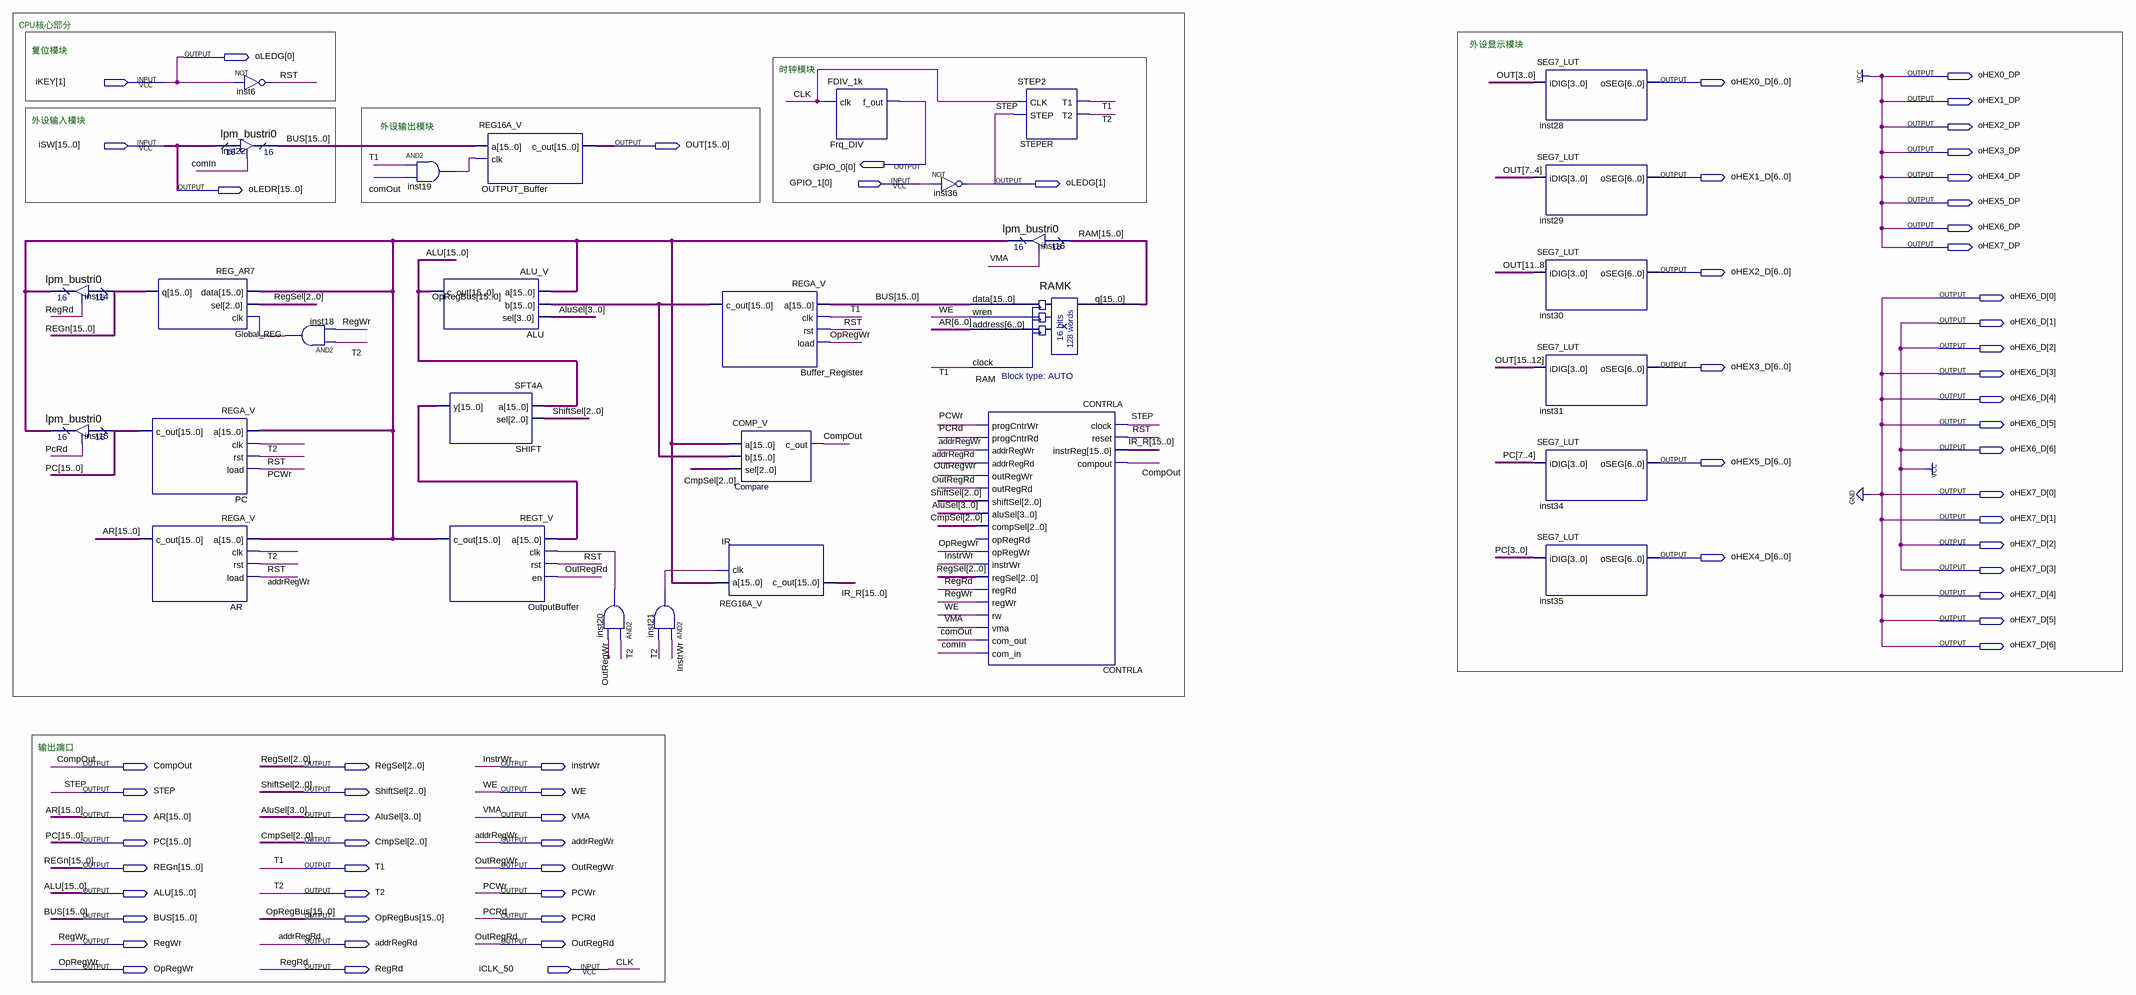
[diagram p0: schematic sheet]
// Quartus schematic kx9016.bdf as structural Verilog: 30 symbols, 63 pins
module kx9016 (
  input  [1:1] iKEY,
  input  [15:0] iSW,
  input  [0:0] GPIO_1,
  input  iCLK_50,
  output [1:0] oLEDG,
  output oHEX0_DP,
  output [6:0] oHEX0_D,
  output oHEX1_DP,
  output oHEX2_DP,
  output [15:0] OUT,
  output oHEX3_DP,
  output [0:0] GPIO_0,
  output [6:0] oHEX1_D,
  output oHEX4_DP,
  output [15:0] oLEDR,
  output oHEX5_DP,
  output oHEX6_DP,
  output oHEX7_DP,
  output [6:0] oHEX2_D,
  output [6:0] oHEX6_D,
  output [6:0] oHEX3_D,
  output [6:0] oHEX5_D,
  output [6:0] oHEX7_D,
  output [6:0] oHEX4_D,
  output CompOut,
  output [2:0] RegSel,
  output instrWr,
  output STEP,
  output [2:0] ShiftSel,
  output WE,
  output [15:0] AR,
  output [3:0] AluSel,
  output VMA,
  output [15:0] PC,
  output [2:0] CmpSel,
  output addrRegWr,
  output [15:0] REGn,
  output T1,
  output OutRegWr,
  output [15:0] ALU,
  output T2,
  output PCWr,
  output [15:0] BUS,
  output [15:0] OpRegBus,
  output PCRd,
  output RegWr,
  output addrRegRd,
  output OutRegRd,
  output OpRegWr,
  output RegRd
);

  wire comIn, comOut, inst18_out, inst19_out, inst20_out, inst21_out, RST;
  wire [15:0] inst14_tridata, IR_R, RAM, SHIFT_y;

  lpm_bustri0 inst14 (.enabledt(RegRd), .data(REGn), .tridata(inst14_tridata));
  lpm_bustri0 inst15 (.enabledt(PCRd), .data(PC), .tridata(inst14_tridata));
  REG_AR7 Global_REG (.data(inst14_tridata), .sel(RegSel), .clk(inst18_out), .q(REGn));
  REGA_V u_PC (.a(inst14_tridata), .clk(T2), .rst(RST), .load(PCWr), .c_out(PC));
  REGA_V u_AR (.a(inst14_tridata), .clk(T2), .rst(RST), .load(addrRegWr), .c_out(AR));
  lpm_bustri0 inst22 (.enabledt(comIn), .data(iSW), .tridata(BUS));
  not inst6 (RST, iKEY[1]);
  and inst18 (inst18_out, T2, RegWr);
  and inst19 (inst19_out, T1, comOut);
  ALU_V u_ALU (.a(inst14_tridata), .b(OpRegBus), .sel(AluSel), .c_out(ALU));
  SFT4A SHIFT (.a(ALU), .sel(ShiftSel), .y(SHIFT_y));
  REGT_V OutputBuffer (.a(SHIFT_y), .clk(inst20_out), .rst(RST), .en(OutRegRd), .c_out(inst14_tridata));
  REG16A_V OUTPUT_Buffer (.a(BUS), .clk(inst19_out), .c_out(OUT));
  and inst20 (inst20_out, T2, OutRegWr);
  and inst21 (inst21_out, instrWr, T2);
  REGA_V Buffer_Register (.a(BUS), .clk(T1), .rst(RST), .load(OpRegWr), .c_out(OpRegBus));
  REG16A_V IR (.a(inst14_tridata), .clk(inst21_out), .c_out(IR_R));
  COMP_V Compare (.a(inst14_tridata), .b(OpRegBus), .sel(CmpSel), .c_out(CompOut));
  FDIV_1k Frq_DIV (.clk(iCLK_50), .f_out(GPIO_0[0]));
  not inst36 (oLEDG[1], GPIO_1[0]);
  RAMK u_RAM (.data(BUS), .wren(WE), .address(AR[6:0]), .clock(T1), .q(RAM));
  CONTRLA CONTRLA (
    .clock(oLEDG[1]), .reset(RST), .instrReg(IR_R), .compout(CompOut), .progCntrWr(PCWr), .progCntrRd(PCRd),
    .addrRegWr(addrRegWr), .addrRegRd(addrRegRd), .outRegWr(OutRegWr), .outRegRd(OutRegRd),
    .shiftSel(ShiftSel), .aluSel(AluSel), .compSel(CmpSel), .opRegWr(OpRegWr), .instrWr(instrWr),
    .regSel(RegSel), .regRd(RegRd), .regWr(RegWr), .rw(WE), .vma(VMA), .com_out(comOut), .com_in(comIn));  // open: opRegRd
  STEP2 STEPER (.CLK(iCLK_50), .STEP(oLEDG[1]), .T1(T1), .T2(T2));
  lpm_bustri0 inst16 (.enabledt(VMA), .data(RAM), .tridata(inst14_tridata));
  SEG7_LUT inst28 (.iDIG(OUT[3:0]), .oSEG(oHEX0_D));
  SEG7_LUT inst29 (.iDIG(OUT[7:4]), .oSEG(oHEX1_D));
  SEG7_LUT inst30 (.iDIG(OUT[11:8]), .oSEG(oHEX2_D));
  SEG7_LUT inst31 (.iDIG(OUT[15:12]), .oSEG(oHEX3_D));
  SEG7_LUT inst34 (.iDIG(PC[7:4]), .oSEG(oHEX5_D));
  SEG7_LUT inst35 (.iDIG(PC[3:0]), .oSEG(oHEX4_D));

  assign oHEX0_DP = 1'b1;
  assign oHEX1_DP = 1'b1;
  assign oHEX2_DP = 1'b1;
  assign oHEX3_DP = 1'b1;
  assign oHEX4_DP = 1'b1;
  assign oHEX5_DP = 1'b1;
  assign oHEX6_D = 7'b1000110;
  assign oHEX6_DP = 1'b1;
  assign oHEX7_D = 7'b0001100;
  assign oHEX7_DP = 1'b1;
  assign oLEDG[0] = iKEY[1];
  assign oLEDR = iSW;
  assign STEP = oLEDG[1];

  // Other names for the same wires on the sheet: CLK = iCLK_50

  // Notes on the sheet:
  //   CPU核心部分
  //   外设显示模块
  //   复位模块
  //   时钟模块
  //   外设输入模块
  //   外设输出模块
  //   输出端口
endmodule
